# Altium schematic sheet PP2_ptB.SchDoc
size 254 x 254 mm
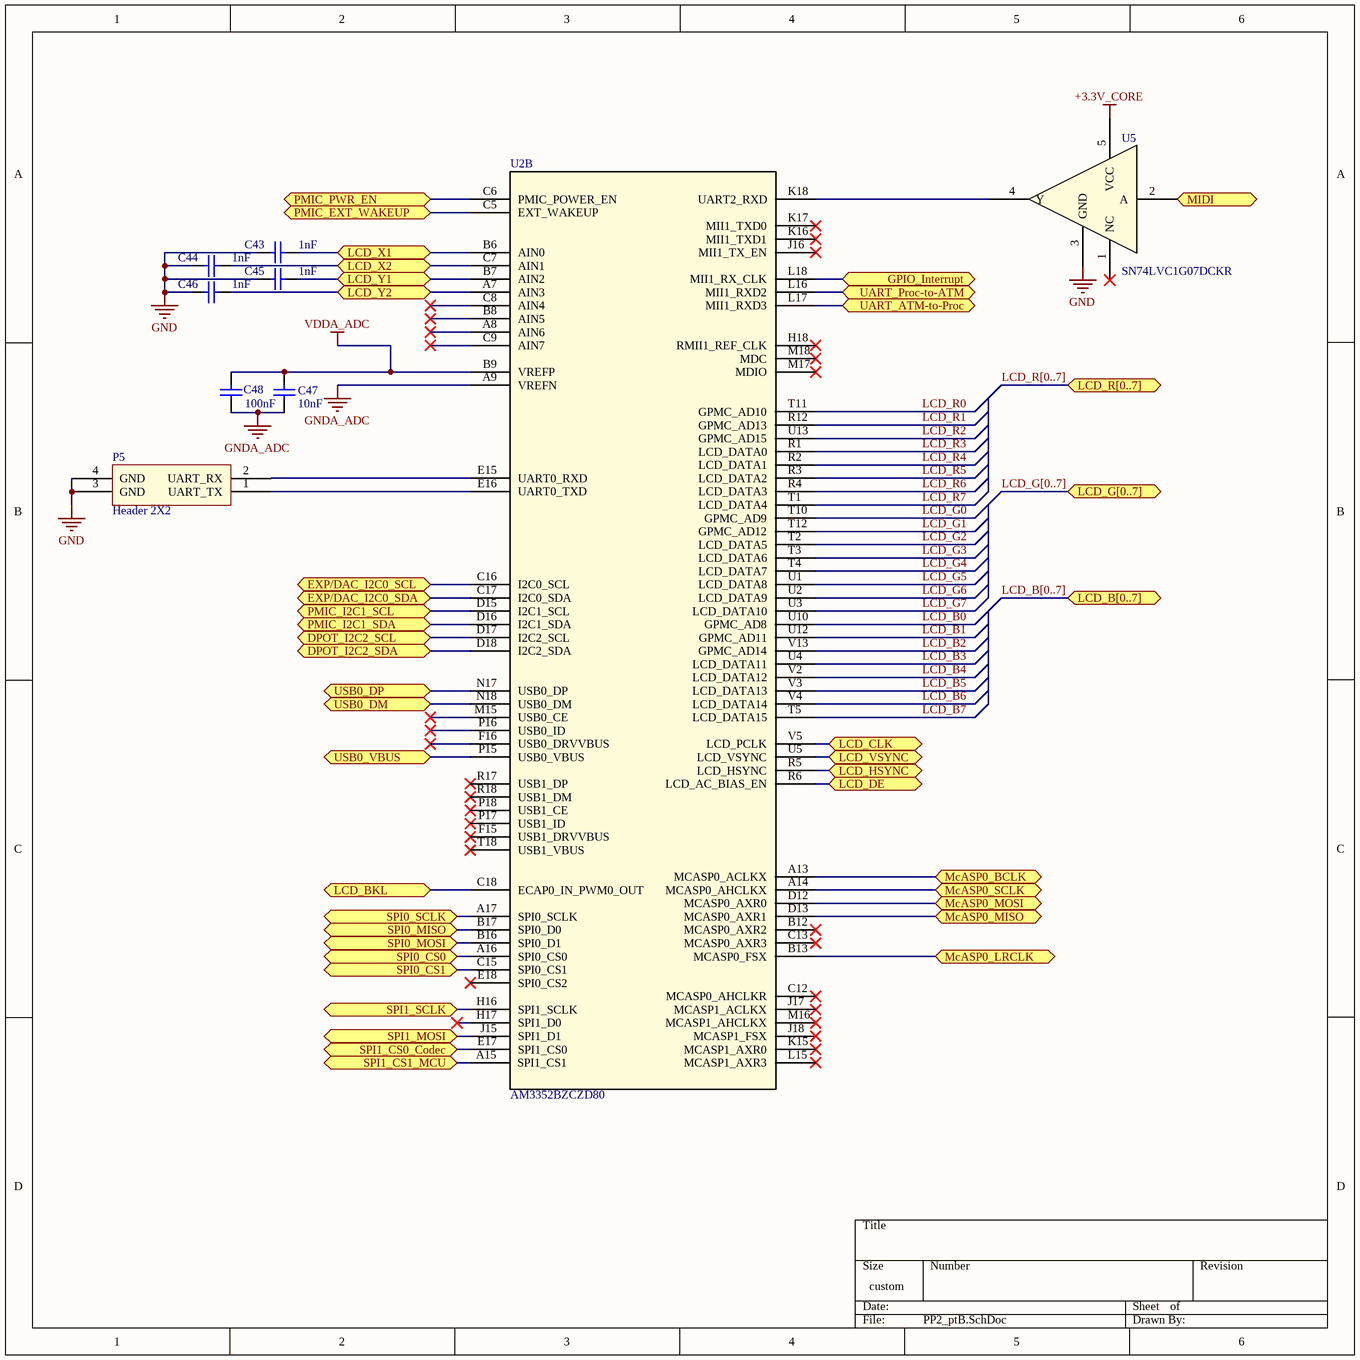
[diagram p0: PP2_ptB.SchDoc]

## Parts
C43  value 1nF  [CAPC1608X08]  (hidden comment: Cap 1nF)
C44  value 1nF  [CAPC1608X08]  (hidden comment: Cap 1nF)
C45  value 1nF  [CAPC1608X08]  (hidden comment: Cap 1nF)
C46  value 1nF  [CAPC1608X08]  (hidden comment: Cap 1nF)
C47  value 10nF  [CAPC1005X05 (0402)]  (hidden comment: Cap 10uF)
C48  value 100nF  [CAPC1005X05 (0402)]  (hidden comment: Cap 100nF)
P5  Header 2X2  [CONN_1241050-2_T]
U2  AM3352BZCZD80  [ZCZ324]  (part B of 4)
U5  SN74LVC1G07DCKR  [DCK5]

## Ports
DPOT_I2C2_SCL, DPOT_I2C2_SDA, EXP/DAC_I2C0_SCL, EXP/DAC_I2C0_SDA, GPIO_Interrupt, LCD_B[0..7], LCD_BKL, LCD_CLK, LCD_DE, LCD_G[0..7], LCD_HSYNC, LCD_R[0..7], LCD_VSYNC, LCD_X1, LCD_X2, LCD_Y1, LCD_Y2, McASP0_BCLK, McASP0_LRCLK, McASP0_MISO, McASP0_MOSI, McASP0_SCLK, MIDI (in), PMIC_EXT_WAKEUP, PMIC_I2C1_SCL, PMIC_I2C1_SDA, PMIC_PWR_EN, SPI0_CS0, SPI0_CS1, SPI0_MISO, SPI0_MOSI, SPI0_SCLK, SPI1_CS0_Codec, SPI1_CS1_MCU, SPI1_MOSI, SPI1_SCLK, UART_ATM-to-Proc, UART_Proc-to-ATM, USB0_DM, USB0_DP, USB0_VBUS

## Nets
+3.3V_CORE: U5.5(VCC)
GND: C43.1 C44.1 C45.1 C46.1 P5.3(GND) P5.4(GND) U5.3(GND)
GNDA_ADC: C47.2 C48.2 U2.A9(VREFN)
VDDA_ADC: C47.1 C48.1 U2.B9(VREFP)
DPOT_I2C2_SCL: U2.D17(I2C2_SCL) ; port DPOT_I2C2_SCL
DPOT_I2C2_SDA: U2.D18(I2C2_SDA) ; port DPOT_I2C2_SDA
EXP/DAC_I2C0_SCL: U2.C16(I2C0_SCL) ; port EXP/DAC_I2C0_SCL
EXP/DAC_I2C0_SDA: U2.C17(I2C0_SDA) ; port EXP/DAC_I2C0_SDA
GPIO_Interrupt: U2.L18(MII1_RX_CLK) ; port GPIO_Interrupt
LCD_B0: U2.U10(GPMC_AD8)
LCD_B1: U2.U12(GPMC_AD11)
LCD_B2: U2.V13(GPMC_AD14)
LCD_B3: U2.U4(LCD_DATA11)
LCD_B4: U2.V2(LCD_DATA12)
LCD_B5: U2.V3(LCD_DATA13)
LCD_B6: U2.V4(LCD_DATA14)
LCD_B7: U2.T5(LCD_DATA15)
LCD_BKL: U2.C18(ECAP0_IN_PWM0_OUT) ; port LCD_BKL
LCD_CLK: U2.V5(LCD_PCLK) ; port LCD_CLK
LCD_DE: U2.R6(LCD_AC_BIAS_EN) ; port LCD_DE
LCD_G0: U2.T10(GPMC_AD9)
LCD_G1: U2.T12(GPMC_AD12)
LCD_G2: U2.T2(LCD_DATA5)
LCD_G3: U2.T3(LCD_DATA6)
LCD_G4: U2.T4(LCD_DATA7)
LCD_G5: U2.U1(LCD_DATA8)
LCD_G6: U2.U2(LCD_DATA9)
LCD_G7: U2.U3(LCD_DATA10)
LCD_HSYNC: U2.R5(LCD_HSYNC) ; port LCD_HSYNC
LCD_R0: U2.T11(GPMC_AD10)
LCD_R1: U2.R12(GPMC_AD13)
LCD_R2: U2.U13(GPMC_AD15)
LCD_R3: U2.R1(LCD_DATA0)
LCD_R4: U2.R2(LCD_DATA1)
LCD_R5: U2.R3(LCD_DATA2)
LCD_R6: U2.R4(LCD_DATA3)
LCD_R7: U2.T1(LCD_DATA4)
LCD_VSYNC: U2.U5(LCD_VSYNC) ; port LCD_VSYNC
LCD_X1: C43.2 U2.B6(AIN0) ; port LCD_X1
LCD_X2: C44.2 U2.C7(AIN1) ; port LCD_X2
LCD_Y1: C45.2 U2.B7(AIN2) ; port LCD_Y1
LCD_Y2: C46.2 U2.A7(AIN3) ; port LCD_Y2
McASP0_BCLK: U2.A13(MCASP0_ACLKX) ; port McASP0_BCLK
McASP0_LRCLK: U2.B13(MCASP0_FSX) ; port McASP0_LRCLK
McASP0_MISO: U2.D13(MCASP0_AXR1) ; port McASP0_MISO
McASP0_MOSI: U2.D12(MCASP0_AXR0) ; port McASP0_MOSI
McASP0_SCLK: U2.A14(MCASP0_AHCLKX) ; port McASP0_SCLK
MIDI: U5.2(A) ; port MIDI
PMIC_EXT_WAKEUP: U2.C5(EXT_WAKEUP) ; port PMIC_EXT_WAKEUP
PMIC_I2C1_SCL: U2.D15(I2C1_SCL) ; port PMIC_I2C1_SCL
PMIC_I2C1_SDA: U2.D16(I2C1_SDA) ; port PMIC_I2C1_SDA
PMIC_PWR_EN: U2.C6(PMIC_POWER_EN) ; port PMIC_PWR_EN
SPI0_CS0: U2.A16(SPI0_CS0) ; port SPI0_CS0
SPI0_CS1: U2.C15(SPI0_CS1) ; port SPI0_CS1
SPI0_MISO: U2.B17(SPI0_D0) ; port SPI0_MISO
SPI0_MOSI: U2.B16(SPI0_D1) ; port SPI0_MOSI
SPI0_SCLK: U2.A17(SPI0_SCLK) ; port SPI0_SCLK
SPI1_CS0_Codec: U2.E17(SPI1_CS0) ; port SPI1_CS0_Codec
SPI1_CS1_MCU: U2.A15(SPI1_CS1) ; port SPI1_CS1_MCU
SPI1_MOSI: U2.J15(SPI1_D1) ; port SPI1_MOSI
SPI1_SCLK: U2.H16(SPI1_SCLK) ; port SPI1_SCLK
UART_ATM-to-Proc: U2.L17(MII1_RXD3) ; port UART_ATM-to-Proc
UART_Proc-to-ATM: U2.L16(MII1_RXD2) ; port UART_Proc-to-ATM
USB0_DM: U2.N18(USB0_DM) ; port USB0_DM
USB0_DP: U2.N17(USB0_DP) ; port USB0_DP
USB0_VBUS: U2.P15(USB0_VBUS) ; port USB0_VBUS
NetP5_1: P5.1(UART_TX) U2.E16(UART0_TXD)
NetP5_2: P5.2(UART_RX) U2.E15(UART0_RXD)
NetU2_K18: U2.K18(UART2_RXD) U5.4(Y)

Not connected (* = marked no-connect by the designer): U2 A8(AIN6)* B8(AIN5)* B12(MCASP0_AXR2)* C8(AIN4)* C9(AIN7)* C12(MCASP0_AHCLKR)* C13(MCASP0_AXR3)* E18(SPI0_CS2)* F15(USB1_DRVVBUS)* F16(USB0_DRVVBUS)* H17(SPI1_D0)* H18(RMII1_REF_CLK)* J16(MII1_TX_EN)* J17(MCASP1_ACLKX)* J18(MCASP1_FSX)* K15(MCASP1_AXR0)* K16(MII1_TXD1)* K17(MII1_TXD0)* L15(MCASP1_AXR3)* M15(USB0_CE)* M16(MCASP1_AHCLKX)* M17(MDIO)* M18(MDC)* P16(USB0_ID)* P17(USB1_ID)* P18(USB1_CE)* R17(USB1_DP)* R18(USB1_DM)* T18(USB1_VBUS)*; U5 1(NC)*

## Buses and harness runs
bus LCD_B[0..7] = port LCD_B[0..7]
bus LCD_G[0..7] = port LCD_G[0..7]
bus LCD_R[0..7] = port LCD_R[0..7]

## Library data of the parts
C43-C46 = Cap: Capacitor; Fabricant: MURATA; Fournisseur: Farnell; RefFabricant: GRT1885C1H102JA02D; RefFournisseur: 2672134; Case: 0603 [1608 Metric]; DataSheet: http://www.farnell.com/datasheets/2165937.pdf
C47 = Cap: Capacitor; Fabricant: TDK; Fournisseur: Farnell; RefFabricant: C1005X8R1E103K050BA; RefFournisseur: 2525066; Case: 0402 [1005 Metric]; DataSheet: http://www.farnell.com/datasheets/1936795.pdf
C48 = Cap: Capacitor; Fabricant: MULTICOMP; Fournisseur: Farnell; RefFabricant: MC0402N101J160CT; RefFournisseur: 2627387; Case: 0402 [1005 Metric]; DataSheet: http://www.farnell.com/datasheets/2117933.pdf
P5 = UART: Header, 2-Pin, Dual row; Fournisseur: Farnell; RefFournisseur: 9689559; Fabricant: AMP - TE CONNECTIVITY; RefFabricant: 1241050-2; DataSheet: http://www.farnell.com/datasheets/318453.pdf
U2 = AM3352BZCZD80: Microprocesseur ARM; Fabricant: TEXAS INSTRUMENTS; Fournisseur: Olimex; RefFabricant: AM3352ZCZD72; RefFournisseur: AM3352ZCZD72; DataSheet: http://www.ti.com/lit/ds/symlink/am3352.pdf
U5 = SN74LVC1G07DCKR: Buffers & Transmetteurs; RefFournisseur: 1287544; Fabricant: TEXAS INSTRUMENTS; Fournisseur: Farnell; RefFabricant: SN74LVC1G07DCKR; DataSheet: http://www.ti.com/lit/ds/symlink/sn74lvc1g07.pdf